# Altium schematic sheet Project_Overview.SchDoc: Project overview
size A4; Date: Not used; ApprovedBy: Not used; CheckedBy: Not used; Author: Not used; CompanyName: STMicroelectronics; DrawnBy: Not used; Engineer: Not used; Organization: Not used; Address1: Not used; Address2: Not used; Address3: Not used; Address4: Not used; DocumentNumber: Not used; Revision: Not used; SheetNumber: 1; SheetTotal: 8; CurrentTime: Not used; CurrentDate: Not used; Time: Not used; DocumentFullPathAndName: Not used; DocumentName: Not used; ModifiedDate: Not used; ImagePath: Not used; ProjectName: Not used; Application_BuildNumber: Not used
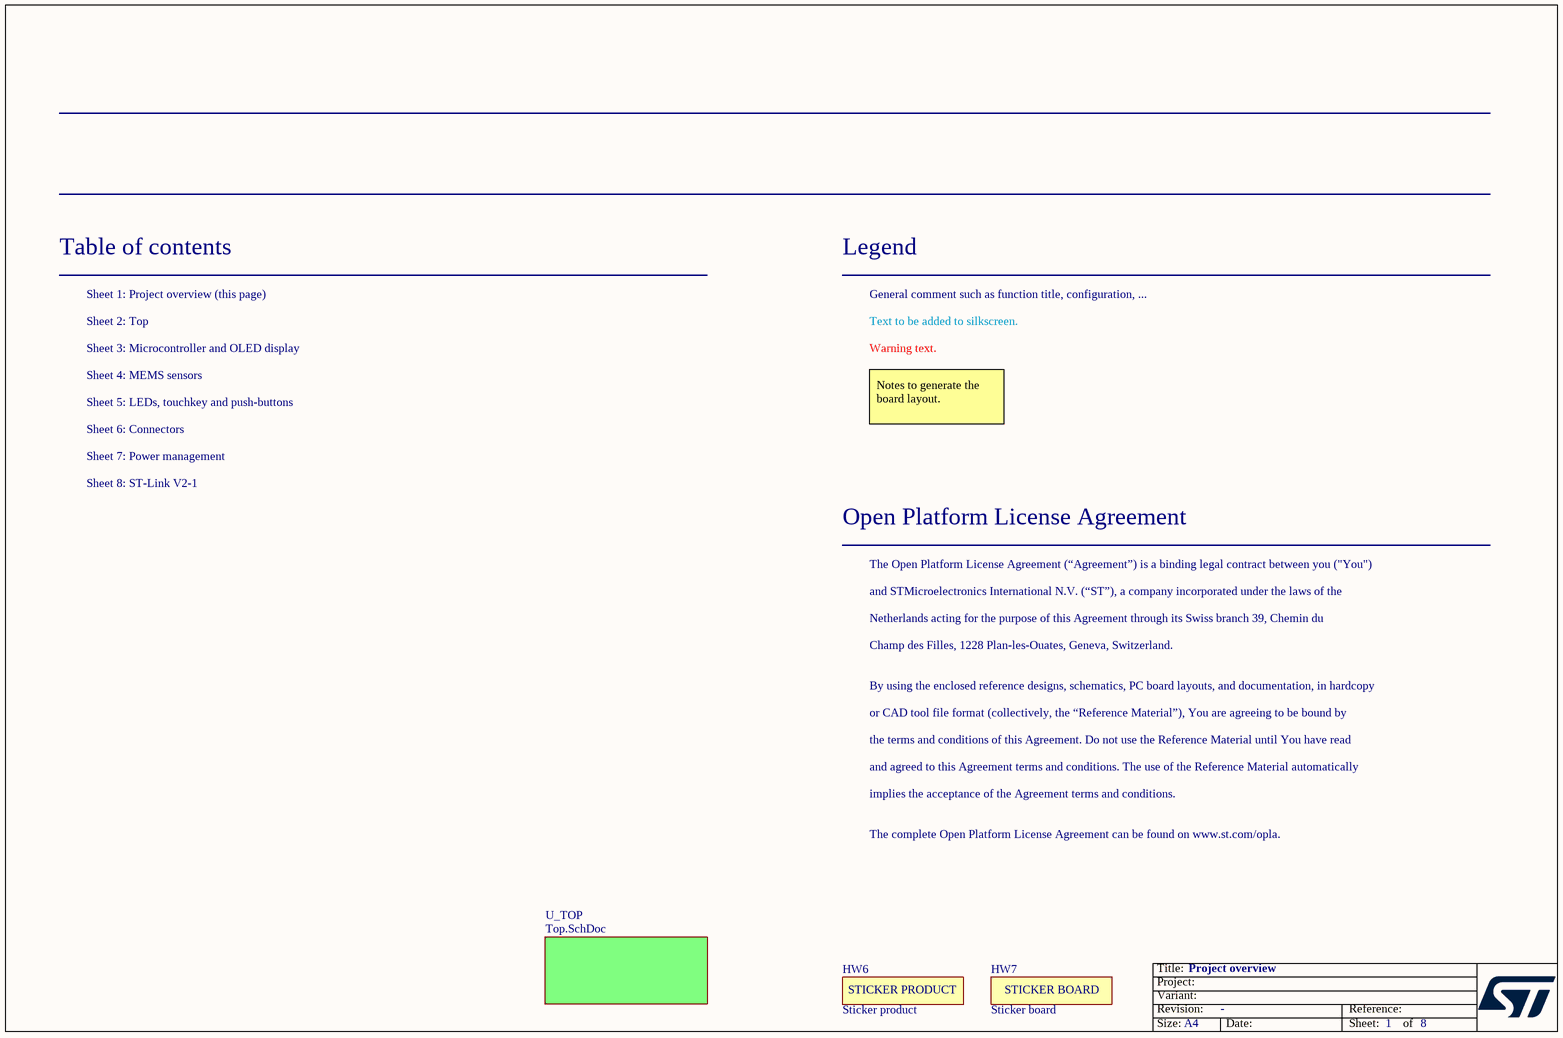
[diagram p0: Project_Overview.SchDoc]

## Parts
HW6  value Sticker product  [STICKER_PRODUCT_25X9]  (hidden comment: STICKER_PRODUCT)  (no BOM)
HW7  value Sticker board  [STICKER_BOARD_25X9]  (hidden comment: STICKER_BOARD)  (no BOM)

## Sub-sheets
U_TOP = Top.SchDoc: no entries

## Notes on the sheet
- Table of contents
- Sheet 1: Project overview (this page)
- Legend
- General comment such as function title, configuration, ...
- Sheet 2: Top
- Sheet 3: Microcontroller and OLED display
- Sheet 4: MEMS sensors
- Text to be added to silkscreen.
- Warning text.
- Sheet 6: Connectors
- Sheet 5: LEDs, touchkey and push-buttons
- Notes to generate the board layout.
- Sheet 7: Power management
- Sheet 8: ST-Link V2-1
- Open Platform License Agreement
- The Open Platform License Agreement (“Agreement”) is a binding legal contract between you ("You")
- and STMicroelectronics International N.V. (“ST”), a company incorporated under the laws of the
- Netherlands acting for the purpose of this Agreement through its Swiss branch 39, Chemin du
- Champ des Filles, 1228 Plan-les-Ouates, Geneva, Switzerland.
- By using the enclosed reference designs, schematics, PC board layouts, and documentation, in hardcopy
- or CAD tool file format (collectively, the “Reference Material”), You are agreeing to be bound by
- the terms and conditions of this Agreement. Do not use the Reference Material until You have read
- and agreed to this Agreement terms and conditions. The use of the Reference Material automatically
- implies the acceptance of the Agreement terms and conditions.
- The complete Open Platform License Agreement can be found on www.st.com/opla.
- Title:
- Project:
- Size:
- Revision:
- Variant:
- A4
- -
- Date:
- Reference:
- Sheet:
- of
- (in symbol MCD-00235) STICKER BOARD
- (in symbol MCD-00547) STICKER PRODUCT

## Library data of the parts
HW6 = MCD-00547: Sticker product 25x9 mm; Part_Preference: Recommended; Part_Type: Misc; Internal_Part_Number: MCD-00547; Status: Released; Manufacturer: N/A; Manufacturer_Part_Number: N/A; Alternate_Manufacturer: N/A; Alternate_Manufacturer_Part_Number: N/A; Package: N/A; ComponentLink1URL: N/A; Order_Code_Digikey: N/A; Order_Code_Farnell: N/A; Order_Code_RS: N/A
HW7 = MCD-00235: Sticker Board 25x9 mm; Part_Preference: Recommended; Part_Type: Misc; Internal_Part_Number: MCD-00235; Status: Released; Manufacturer: N/A; Manufacturer_Part_Number: N/A; Alternate_Manufacturer: N/A; Alternate_Manufacturer_Part_Number: N/A; Package: N/A; ComponentLink1URL: N/A; Order_Code_Digikey: N/A; Order_Code_Farnell: N/A; Order_Code_RS: N/A